# Altium schematic sheet 45. CAN TRANSCEIVERS.SchDoc: CAN TRANSCEIVERS
size 513 x 386 mm; Project: PROC154E2(001)_SK_AM69; Issue: 1.0; RevCode: E3; Page Create Date: March  8, 1995; Variant Name: Core Design; Schematic Page Number: 45; Page Number: 45; Page Size: C; Comment: MISTRAL_TITLEBLK_CSIZE_1; Page Count: 62; Schematic Page Count: 62; Name: PROC154E2 001 SK AM69; DsnPath: C:\Users\danie\Downloads\sprr466c\PROC154E3_RP\PROC154E3_SCH.DSN; SchematicName: SCHEMATIC1; PageName: 45. CAN TRANSCEIVERS; PageSize: C; TopSchematic: True
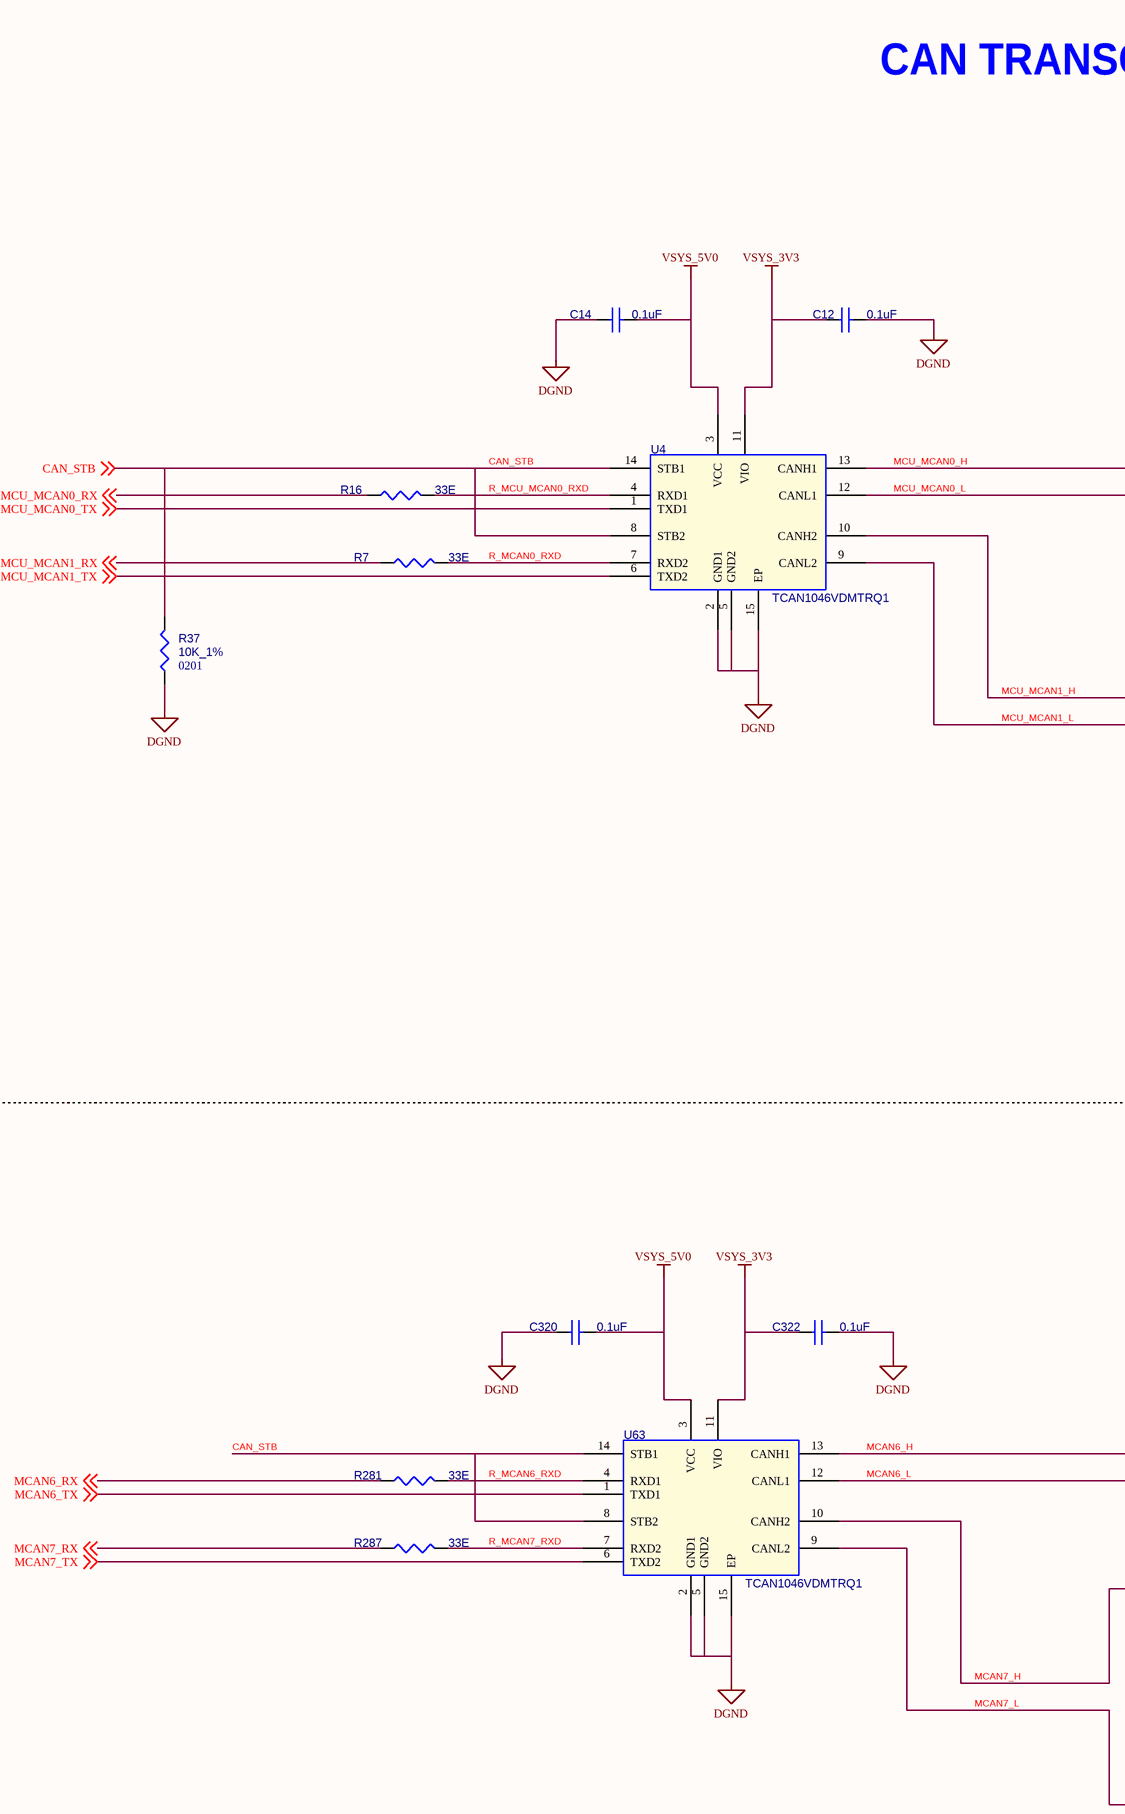
[diagram p0: 45. CAN TRANSCEIVERS.SchDoc, left]
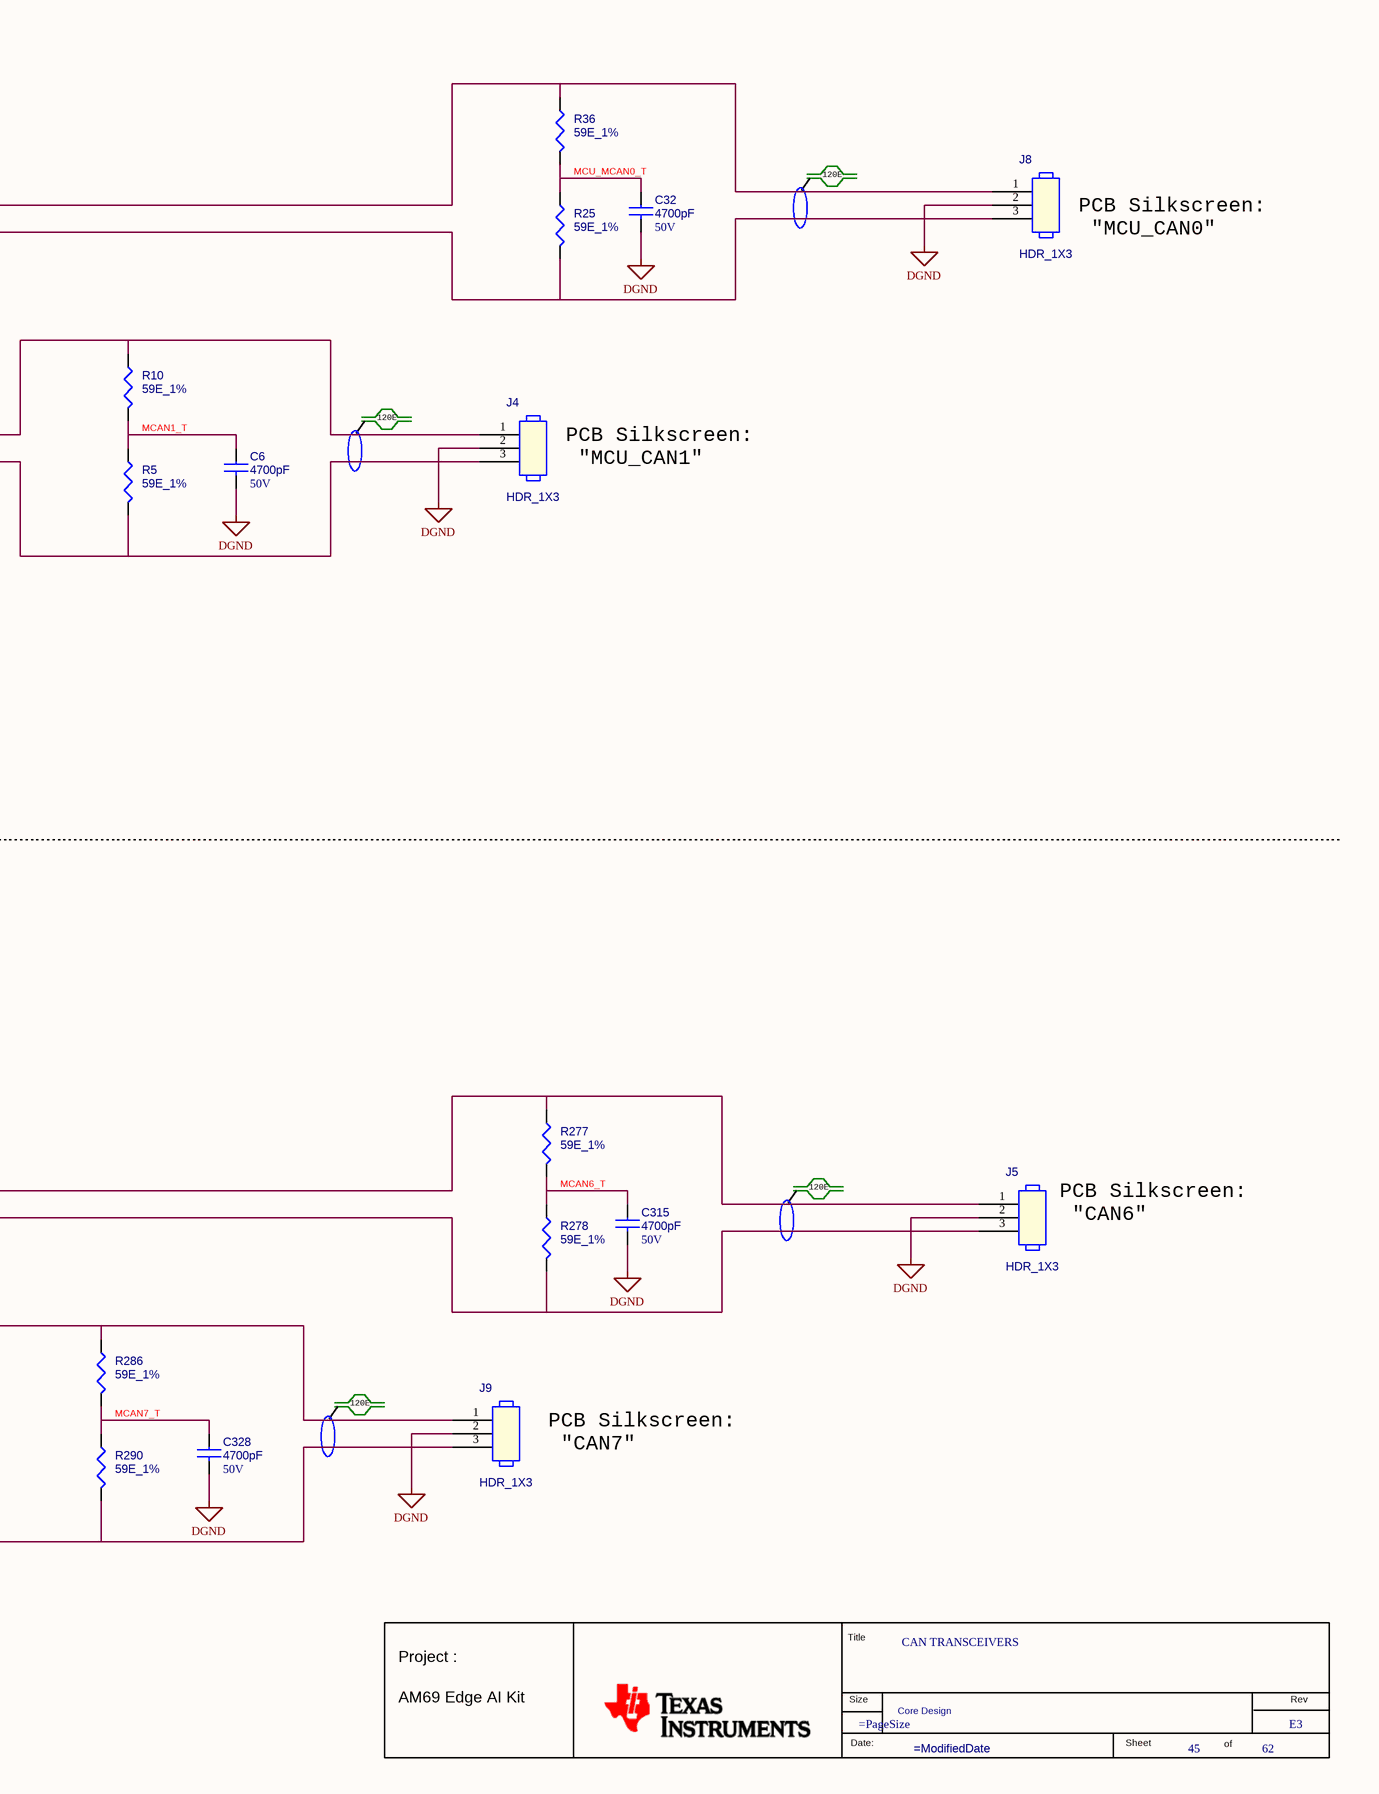
[diagram p1: 45. CAN TRANSCEIVERS.SchDoc, right]

## Parts
*  RevCode: E3  Title: CAN TRANSCEIVERS  Page Number: 45  Page Count: 62  Variant Name: Core Design  (hidden comment: MISTRAL_TITLEBLK_CSIZE_1)  (graphical)
C6  4700pF  Voltage: 50V  [CAP0402_0-75]
C12  0.1uF  [CAP0201_0-5]
C14  0.1uF  [CAP0201_0-5]
C32  4700pF  Voltage: 50V  [CAP0402_0-75]
C315  4700pF  Voltage: 50V  [CAP0402_0-75]
C320  0.1uF  [CAP0201_0-5]
C322  0.1uF  [CAP0201_0-5]
C328  4700pF  Voltage: 50V  [CAP0402_0-75]
J4  HDR_1X3  [HDR_1X3_100_S_T]
J5  HDR_1X3  [HDR_1X3_100_S_T]
J8  HDR_1X3  [HDR_1X3_100_S_T]
J9  HDR_1X3  [HDR_1X3_100_S_T]
R5  59E_1%  [RES0402_0-5]
R7  33E  [RES0201_0-5]
R10  59E_1%  [RES0402_0-5]
R16  33E  [RES0201_0-5]
R25  59E_1%  [RES0402_0-5]
R36  59E_1%  [RES0402_0-5]
R37  10K_1%  Package: 0201  [RES0201_0-5]
R277  59E_1%  [RES0402_0-5]
R278  59E_1%  [RES0402_0-5]
R281  33E  [RES0201_0-5]
R286  59E_1%  [RES0402_0-5]
R287  33E  [RES0201_0-5]
R290  59E_1%  [RES0402_0-5]
U4  TCAN1046VDMTRQ1  [VSON14_25-59_120X180_0-9]
U63  TCAN1046VDMTRQ1  [VSON14_25-59_120X180_0-9]

## Nets
DGND: C6.2 C12.2 C14.1 C32.2 C315.2 C320.1 C322.2 C328.2 J4.2 J5.2 J8.2 J9.2 R37.1 U4.2(GND1) U4.5(GND2) U4.15(EP) U63.2(GND1) U63.5(GND2) U63.15(EP)
VSYS_3V3: C12.1 C322.1 U4.11(VIO) U63.11(VIO)
VSYS_5V0: C14.2 C320.2 U4.3(VCC) U63.3(VCC)
CAN_STB: R37.2 U4.8(STB2) U4.14(STB1) U63.8(STB2) U63.14(STB1) ; off-sheet CAN_STB
MCAN1_T: C6.1 R5.1 R10.2
MCAN6_H: J5.1 R277.1 U63.13(CANH1)
MCAN6_L: J5.3 R278.2 U63.12(CANL1)
MCAN6_RX: R281.1 ; off-sheet MCAN6_RX
MCAN6_T: C315.1 R277.2 R278.1
MCAN6_TX: U63.1(TXD1) ; off-sheet MCAN6_TX
MCAN7_H: J9.1 R286.1 U63.10(CANH2)
MCAN7_L: J9.3 R290.2 U63.9(CANL2)
MCAN7_RX: R287.1 ; off-sheet MCAN7_RX
MCAN7_T: C328.1 R286.2 R290.1
MCAN7_TX: U63.6(TXD2) ; off-sheet MCAN7_TX
MCU_MCAN0_H: J8.1 R36.1 U4.13(CANH1)
MCU_MCAN0_L: J8.3 R25.2 U4.12(CANL1)
MCU_MCAN0_RX: R16.1 ; off-sheet MCU_MCAN0_RX
MCU_MCAN0_T: C32.1 R25.1 R36.2
MCU_MCAN0_TX: U4.1(TXD1) ; off-sheet MCU_MCAN0_TX
MCU_MCAN1_H: J4.1 R10.1 U4.10(CANH2)
MCU_MCAN1_L: J4.3 R5.2 U4.9(CANL2)
MCU_MCAN1_RX: R7.1 ; off-sheet MCU_MCAN1_RX
MCU_MCAN1_TX: U4.6(TXD2) ; off-sheet MCU_MCAN1_TX
R_MCAN0_RXD: R7.2 U4.7(RXD2)
R_MCAN6_RXD: R281.2 U63.4(RXD1)
R_MCAN7_RXD: R287.2 U63.7(RXD2)
R_MCU_MCAN0_RXD: R16.2 U4.4(RXD1)

## Notes on the sheet
- CAN TRANSCEIVERS
- 120E
- (near J8) PCB Silkscreen:
  "MCU_CAN0"
- (near J4) PCB Silkscreen:
  "MCU_CAN1"
- (near J5) PCB Silkscreen:
  "CAN6"
- PCB Silkscreen:
  "CAN7"
- (in symbol MISTRAL_TITLEBLK_CSIZE_1) Title; Project :; Size; Rev; AM69 Edge AI Kit; Date:; Sheet; of

## Library data of the parts
* = MISTRAL_TITLEBLK_CSIZE_1: Issue: 1.0; Project: PROC154E2(001)_SK_AM69; Name: PROC154E2 001 SK AM69; Page Create Date: March  8, 1995; Page Size: =PageSize; Page Modify Date: =ModifiedDate; Schematic Page Count: 62; Schematic Page Number: 45
C6 = CAP_Dup1: CAP CERAMIC 4700pF 50V 10% X7R AUTO 0402; Part Reference: C6; Part_type: CAPACITORS\CERAMIC; Mfr_part_number: GRT155R71H472KE01D; Mfr_name: MURATA; Mistral Part No: 120019020002-R; Custom_Duty: 15%; Customs_HS_Code: 85322990; Wattage: NA; Project: TI_DRA821 SK EVM BRD; Value: 4700pF; PCB Footprint: CAP0402_0-75; Chkd/date: MANIRAJA/250221; Crtd /date: ALVY/240221; Datasheet: Y:\MIS_DATABASE\DATASHEETS\CAPACITORS\GRT155R71H472KE01.PDF; Temperature: -55°C+125°C; Weight: NA; Height: 0.55MM; Library Ref: CAP; Distributor_part_number: 81-GRT155R71H472KE1D; Distributor_name: MOUSER; Package: 0402; Tolerance: 10%; Footprint Ref: CAP0402_0-75; MECHANICAL 3D STEP FILE: CAP0402_0-75; Library Path: Y:\MIS_DATABASE\Library\ALTIUM_TOOL\SCHEMATICS_PARTS\MS_DISCRETE_Library.schlib; Footprint Path: Y:\MIS_DATABASE\Library\ALTIUM_TOOL\PCB_FOOTPRINTS\Altium_Footprint_Lib.PcbLib
C12 = CAP_Dup1: CAP CERAMIC 0.1uF 16V 10% X7S AUTO 0201; Part Reference: C12; Mistral Part No: 120021030007-R; Mfr_name: MURATA; Mfr_part_number: GRT033C71C104KE01D; Part_type: CAPACITORS\CERAMIC; Project: J7ES_SK_BRD; Wattage: NA; Customs_HS_Code: 85322990; Custom_Duty: 15%; Value: 0.1uF; PCB Footprint: CAP0201_0-5; Tolerance: 10%; Voltage: 16V; Package: 0201; Distributor_name: DIGIKEY; Distributor_part_number: 490-GRT033C71C104KE01DTR-ND; Height: 0.33MM; Weight: 330mg; Temperature: -55°C+125°C; Datasheet: Y:\MIS_DATABASE\DATASHEETS\CAPACITORS\GRT033C71C104KE01.PDF; Crtd /date: ALVY/110321; Chkd/date: MANIRAJA/110321; MECHANICAL 3D STEP FILE: CAP0201_0-5
C14 = CAP_Dup1: CAP CERAMIC 0.1uF 16V 10% X7S AUTO 0201; Part Reference: C14; Part_type: CAPACITORS\CERAMIC; Mfr_part_number: GRT033C71C104KE01D; Mfr_name: MURATA; Mistral Part No: 120021030007-R; Custom_Duty: 15%; Customs_HS_Code: 85322990; Wattage: NA; Project: J7ES_SK_BRD; Value: 0.1uF; PCB Footprint: CAP0201_0-5; MECHANICAL 3D STEP FILE: CAP0201_0-5; Chkd/date: MANIRAJA/110321; Crtd /date: ALVY/110321; Datasheet: Y:\MIS_DATABASE\DATASHEETS\CAPACITORS\GRT033C71C104KE01.PDF; Temperature: -55°C+125°C; Weight: 330mg; Height: 0.33MM; Distributor_part_number: 490-GRT033C71C104KE01DTR-ND; Distributor_name: DIGIKEY; Package: 0201; Voltage: 16V; Tolerance: 10%
C32 = CAP_Dup1: CAP CERAMIC 4700pF 50V 10% X7R AUTO 0402; Part Reference: C32; Mistral Part No: 120019020002-R; Mfr_name: MURATA; Mfr_part_number: GRT155R71H472KE01D; Part_type: CAPACITORS\CERAMIC; Project: TI_DRA821 SK EVM BRD; Wattage: NA; Customs_HS_Code: 85322990; Custom_Duty: 15%; Value: 4700pF; PCB Footprint: CAP0402_0-75; Footprint Path: Y:\MIS_DATABASE\Library\ALTIUM_TOOL\PCB_FOOTPRINTS\Altium_Footprint_Lib.PcbLib; Library Path: Y:\MIS_DATABASE\Library\ALTIUM_TOOL\SCHEMATICS_PARTS\MS_DISCRETE_Library.schlib; MECHANICAL 3D STEP FILE: CAP0402_0-75; Footprint Ref: CAP0402_0-75; Tolerance: 10%; Package: 0402; Distributor_name: MOUSER; Distributor_part_number: 81-GRT155R71H472KE1D; Library Ref: CAP; Height: 0.55MM; Weight: NA; Temperature: -55°C+125°C; Datasheet: Y:\MIS_DATABASE\DATASHEETS\CAPACITORS\GRT155R71H472KE01.PDF; Crtd /date: ALVY/240221; Chkd/date: MANIRAJA/250221
C315 = CAP_Dup1: CAP CERAMIC 4700pF 50V 10% X7R AUTO 0402; Part Reference: C315; Mistral Part No: 120019020002-R; Mfr_name: MURATA; Mfr_part_number: GRT155R71H472KE01D; Part_type: CAPACITORS\CERAMIC; Project: TI_DRA821 SK EVM BRD; Wattage: NA; Customs_HS_Code: 85322990; Custom_Duty: 15%; Value: 4700pF; PCB Footprint: CAP0402_0-75; Footprint Path: Y:\MIS_DATABASE\Library\ALTIUM_TOOL\PCB_FOOTPRINTS\Altium_Footprint_Lib.PcbLib; Library Path: Y:\MIS_DATABASE\Library\ALTIUM_TOOL\SCHEMATICS_PARTS\MS_DISCRETE_Library.schlib; MECHANICAL 3D STEP FILE: CAP0402_0-75; Footprint Ref: CAP0402_0-75; Tolerance: 10%; Package: 0402; Distributor_name: MOUSER; Distributor_part_number: 81-GRT155R71H472KE1D; Library Ref: CAP; Height: 0.55MM; Weight: NA; Temperature: -55°C+125°C; Datasheet: Y:\MIS_DATABASE\DATASHEETS\CAPACITORS\GRT155R71H472KE01.PDF; Crtd /date: ALVY/240221; Chkd/date: MANIRAJA/250221
C320 = CAP_Dup1: CAP CERAMIC 0.1uF 16V 10% X7S AUTO 0201; Part Reference: C320; Mistral Part No: 120021030007-R; Mfr_name: MURATA; Mfr_part_number: GRT033C71C104KE01D; Part_type: CAPACITORS\CERAMIC; Project: J7ES_SK_BRD; Wattage: NA; Customs_HS_Code: 85322990; Custom_Duty: 15%; Value: 0.1uF; PCB Footprint: CAP0201_0-5; Tolerance: 10%; Voltage: 16V; Package: 0201; Distributor_name: DIGIKEY; Distributor_part_number: 490-GRT033C71C104KE01DTR-ND; Height: 0.33MM; Weight: 330mg; Temperature: -55°C+125°C; Datasheet: Y:\MIS_DATABASE\DATASHEETS\CAPACITORS\GRT033C71C104KE01.PDF; Crtd /date: ALVY/110321; Chkd/date: MANIRAJA/110321; MECHANICAL 3D STEP FILE: CAP0201_0-5
C322 = CAP_Dup1: CAP CERAMIC 0.1uF 16V 10% X7S AUTO 0201; Part Reference: C322; Mistral Part No: 120021030007-R; Mfr_name: MURATA; Mfr_part_number: GRT033C71C104KE01D; Part_type: CAPACITORS\CERAMIC; Project: J7ES_SK_BRD; Wattage: NA; Customs_HS_Code: 85322990; Custom_Duty: 15%; Value: 0.1uF; PCB Footprint: CAP0201_0-5; Tolerance: 10%; Voltage: 16V; Package: 0201; Distributor_name: DIGIKEY; Distributor_part_number: 490-GRT033C71C104KE01DTR-ND; Height: 0.33MM; Weight: 330mg; Temperature: -55°C+125°C; Datasheet: Y:\MIS_DATABASE\DATASHEETS\CAPACITORS\GRT033C71C104KE01.PDF; Crtd /date: ALVY/110321; Chkd/date: MANIRAJA/110321; MECHANICAL 3D STEP FILE: CAP0201_0-5
C328 = CAP_Dup1: CAP CERAMIC 4700pF 50V 10% X7R AUTO 0402; Part Reference: C328; Part_type: CAPACITORS\CERAMIC; Mfr_part_number: GRT155R71H472KE01D; Mfr_name: MURATA; Mistral Part No: 120019020002-R; Custom_Duty: 15%; Customs_HS_Code: 85322990; Wattage: NA; Project: TI_DRA821 SK EVM BRD; Value: 4700pF; PCB Footprint: CAP0402_0-75; Chkd/date: MANIRAJA/250221; Crtd /date: ALVY/240221; Datasheet: Y:\MIS_DATABASE\DATASHEETS\CAPACITORS\GRT155R71H472KE01.PDF; Temperature: -55°C+125°C; Weight: NA; Height: 0.55MM; Library Ref: CAP; Distributor_part_number: 81-GRT155R71H472KE1D; Distributor_name: MOUSER; Package: 0402; Tolerance: 10%; Footprint Ref: CAP0402_0-75; MECHANICAL 3D STEP FILE: CAP0402_0-75; Library Path: Y:\MIS_DATABASE\Library\ALTIUM_TOOL\SCHEMATICS_PARTS\MS_DISCRETE_Library.schlib; Footprint Path: Y:\MIS_DATABASE\Library\ALTIUM_TOOL\PCB_FOOTPRINTS\Altium_Footprint_Lib.PcbLib
J4 = HEADER_3X1: CON HDR 1X3 2.54MM PITCH ST TH; Part Reference: J4; Mistral Part No: 150015100037-R; Mfr_name: WURTH ELECTRONICS INC; Mfr_part_number: 61300311121; Part_type: CONNECTOR\HEADERS; Project: CYPHY_ROADKILL; Tolerance: NA; Customs_HS_Code: 85369090; Custom_Duty: 24%; Value: HDR_1X3; PCB Footprint: HDR_1X3_100_S_T; Voltage: NA; Wattage: NA; Package: THRU-HOLE; Distributor_name: DIGIKEY; Distributor_part_number: 732-5316-ND; Library Ref: HEADER_3X1; Height: 8.54MM; Weight: NA; Temperature: NA; Datasheet: Y:\MIS_DATABASE\DATASHEETS\CONNECTORS\6130XXX.PDF; Crtd /date: VASANTHA/211015; Chkd/date: VASANTHA/211015
J5 = HEADER_3X1: CON HDR 1X3 2.54MM PITCH ST TH; Part Reference: J5; Mistral Part No: 150015100037-R; Mfr_name: WURTH ELECTRONICS INC; Mfr_part_number: 61300311121; Part_type: CONNECTOR\HEADERS; Project: CYPHY_ROADKILL; Tolerance: NA; Customs_HS_Code: 85369090; Custom_Duty: 24%; Value: HDR_1X3; PCB Footprint: HDR_1X3_100_S_T; Voltage: NA; Wattage: NA; Package: THRU-HOLE; Distributor_name: DIGIKEY; Distributor_part_number: 732-5316-ND; Library Ref: HEADER_3X1; Height: 8.54MM; Weight: NA; Temperature: NA; Datasheet: Y:\MIS_DATABASE\DATASHEETS\CONNECTORS\6130XXX.PDF; Crtd /date: VASANTHA/211015; Chkd/date: VASANTHA/211015
J8 = HEADER_3X1: CON HDR 1X3 2.54MM PITCH ST TH; Part Reference: J8; Mistral Part No: 150015100037-R; Mfr_name: WURTH ELECTRONICS INC; Mfr_part_number: 61300311121; Part_type: CONNECTOR\HEADERS; Project: CYPHY_ROADKILL; Tolerance: NA; Customs_HS_Code: 85369090; Custom_Duty: 24%; Value: HDR_1X3; PCB Footprint: HDR_1X3_100_S_T; Voltage: NA; Wattage: NA; Package: THRU-HOLE; Distributor_name: DIGIKEY; Distributor_part_number: 732-5316-ND; Library Ref: HEADER_3X1; Height: 8.54MM; Weight: NA; Temperature: NA; Datasheet: Y:\MIS_DATABASE\DATASHEETS\CONNECTORS\6130XXX.PDF; Crtd /date: VASANTHA/211015; Chkd/date: VASANTHA/211015
J9 = HEADER_3X1: CON HDR 1X3 2.54MM PITCH ST TH; Part Reference: J9; Mistral Part No: 150015100037-R; Mfr_name: WURTH ELECTRONICS INC; Mfr_part_number: 61300311121; Part_type: CONNECTOR\HEADERS; Project: CYPHY_ROADKILL; Tolerance: NA; Customs_HS_Code: 85369090; Custom_Duty: 24%; Value: HDR_1X3; PCB Footprint: HDR_1X3_100_S_T; Voltage: NA; Wattage: NA; Package: THRU-HOLE; Distributor_name: DIGIKEY; Distributor_part_number: 732-5316-ND; Library Ref: HEADER_3X1; Height: 8.54MM; Weight: NA; Temperature: NA; Datasheet: Y:\MIS_DATABASE\DATASHEETS\CONNECTORS\6130XXX.PDF; Crtd /date: VASANTHA/211015; Chkd/date: VASANTHA/211015
R5 = RESISTOR_Dup2: RES 59E 1/10W 1% 0402; Part Reference: R5; Mistral Part No: 110009031010-R; Mfr_name: PANASONIC-ECG; Mfr_part_number: ERJ-2RKF59R0X; Part_type: RESISTORS\FIXED; Project: KHAN_HSST; Voltage: NA; Customs_HS_Code: 85332119; Custom_Duty: 15%; Value: 59E_1%; PCB Footprint: RES0402_0-5; Tolerance: 1%; Wattage: 1/10W; Package: 0402; Distributor_name: DIGIKEY; Distributor_part_number: P59.0LCT-ND; Library Ref: RESISTOR; Footprint Ref: RES0402_0-5; Height: 0.40MM; Weight: 0.8mg; Temperature: -55°C+155°C; Datasheet: Y:\MIS_DATABASE\DATASHEETS\RESISTORS\PAN-ERJSER_NOV17.PDF; Crtd /date: USMAN/031208; Chkd/date: MAZHAR/151208; MECHANICAL 3D STEP FILE: RES0402_0-5; Library Path: Y:\MIS_DATABASE\Library\ALTIUM_TOOL\SCHEMATICS_PARTS\MS_DISCRETE_Library.schlib; Footprint Path: Y:\MIS_DATABASE\Library\ALTIUM_TOOL\PCB_FOOTPRINTS\Altium_Footprint_Lib.PcbLib
R7 = RESISTOR_Dup2: RES 33E 1/20W 5% 0201; Part Reference: R7; Part_type: RESISTORS\FIXED; Mfr_part_number: ERJ-1GNJ330C; Mfr_name: PANASONIC-ECG; Mistral Part No: 110010070052-R; Custom_Duty: 15%; Customs_HS_Code: 85332119; Voltage: NA; Project: TI_AM62x_SKEVM_BRD; Value: 33E; PCB Footprint: RES0201_0-5; Footprint Path: Y:\MIS_DATABASE\Library\ALTIUM_TOOL\PCB_FOOTPRINTS\Altium_Footprint_Lib.PcbLib; Library Path: Y:\MIS_DATABASE\Library\ALTIUM_TOOL\SCHEMATICS_PARTS\MS_DISCRETE_Library.schlib; MECHANICAL 3D STEP FILE: RES0201_0-5; Chkd/date: ALVY/070422; Crtd /date: TAMILARASU/070422; Datasheet: Y:\MIS_DATABASE\DATASHEETS\RESISTORS\PAN-ERJSER_NOV17.PDF; Temperature: -55°C+125°C; Weight: 0.15mg; Height: 0.26MM; Distributor_part_number: P123303CT-ND; Distributor_name: DIGIKEY; Package: 0201; Wattage: 1/20W; Tolerance: 5%; Library Ref: RESISTOR; Footprint Ref: RES0201_0-5
R10 = RESISTOR_Dup2: RES 59E 1/10W 1% 0402; Part Reference: R10; Mistral Part No: 110009031010-R; Mfr_name: PANASONIC-ECG; Mfr_part_number: ERJ-2RKF59R0X; Part_type: RESISTORS\FIXED; Project: KHAN_HSST; Voltage: NA; Customs_HS_Code: 85332119; Custom_Duty: 15%; Value: 59E_1%; PCB Footprint: RES0402_0-5; Tolerance: 1%; Wattage: 1/10W; Package: 0402; Distributor_name: DIGIKEY; Distributor_part_number: P59.0LCT-ND; Library Ref: RESISTOR; Footprint Ref: RES0402_0-5; Height: 0.40MM; Weight: 0.8mg; Temperature: -55°C+155°C; Datasheet: Y:\MIS_DATABASE\DATASHEETS\RESISTORS\PAN-ERJSER_NOV17.PDF; Crtd /date: USMAN/031208; Chkd/date: MAZHAR/151208; MECHANICAL 3D STEP FILE: RES0402_0-5; Library Path: Y:\MIS_DATABASE\Library\ALTIUM_TOOL\SCHEMATICS_PARTS\MS_DISCRETE_Library.schlib; Footprint Path: Y:\MIS_DATABASE\Library\ALTIUM_TOOL\PCB_FOOTPRINTS\Altium_Footprint_Lib.PcbLib
R16 = RESISTOR_Dup2: RES 33E 1/20W 5% 0201; Part Reference: R16; Mistral Part No: 110010070052-R; Mfr_name: PANASONIC-ECG; Mfr_part_number: ERJ-1GNJ330C; Part_type: RESISTORS\FIXED; Project: TI_AM62x_SKEVM_BRD; Voltage: NA; Customs_HS_Code: 85332119; Custom_Duty: 15%; Value: 33E; PCB Footprint: RES0201_0-5; Footprint Ref: RES0201_0-5; Library Ref: RESISTOR; Tolerance: 5%; Wattage: 1/20W; Package: 0201; Distributor_name: DIGIKEY; Distributor_part_number: P123303CT-ND; Height: 0.26MM; Weight: 0.15mg; Temperature: -55°C+125°C; Datasheet: Y:\MIS_DATABASE\DATASHEETS\RESISTORS\PAN-ERJSER_NOV17.PDF; Crtd /date: TAMILARASU/070422; Chkd/date: ALVY/070422; MECHANICAL 3D STEP FILE: RES0201_0-5; Library Path: Y:\MIS_DATABASE\Library\ALTIUM_TOOL\SCHEMATICS_PARTS\MS_DISCRETE_Library.schlib; Footprint Path: Y:\MIS_DATABASE\Library\ALTIUM_TOOL\PCB_FOOTPRINTS\Altium_Footprint_Lib.PcbLib
R25 = RESISTOR_Dup2: RES 59E 1/10W 1% 0402; Part Reference: R25; Mistral Part No: 110009031010-R; Mfr_name: PANASONIC-ECG; Mfr_part_number: ERJ-2RKF59R0X; Part_type: RESISTORS\FIXED; Project: KHAN_HSST; Voltage: NA; Customs_HS_Code: 85332119; Custom_Duty: 15%; Value: 59E_1%; PCB Footprint: RES0402_0-5; Tolerance: 1%; Wattage: 1/10W; Package: 0402; Distributor_name: DIGIKEY; Distributor_part_number: P59.0LCT-ND; Library Ref: RESISTOR; Footprint Ref: RES0402_0-5; Height: 0.40MM; Weight: 0.8mg; Temperature: -55°C+155°C; Datasheet: Y:\MIS_DATABASE\DATASHEETS\RESISTORS\PAN-ERJSER_NOV17.PDF; Crtd /date: USMAN/031208; Chkd/date: MAZHAR/151208; MECHANICAL 3D STEP FILE: RES0402_0-5; Library Path: Y:\MIS_DATABASE\Library\ALTIUM_TOOL\SCHEMATICS_PARTS\MS_DISCRETE_Library.schlib; Footprint Path: Y:\MIS_DATABASE\Library\ALTIUM_TOOL\PCB_FOOTPRINTS\Altium_Footprint_Lib.PcbLib
R36 = RESISTOR_Dup2: RES 59E 1/10W 1% 0402; Part Reference: R36; Mistral Part No: 110009031010-R; Mfr_name: PANASONIC-ECG; Mfr_part_number: ERJ-2RKF59R0X; Part_type: RESISTORS\FIXED; Project: KHAN_HSST; Voltage: NA; Customs_HS_Code: 85332119; Custom_Duty: 15%; Value: 59E_1%; PCB Footprint: RES0402_0-5; Tolerance: 1%; Wattage: 1/10W; Package: 0402; Distributor_name: DIGIKEY; Distributor_part_number: P59.0LCT-ND; Library Ref: RESISTOR; Footprint Ref: RES0402_0-5; Height: 0.40MM; Weight: 0.8mg; Temperature: -55°C+155°C; Datasheet: Y:\MIS_DATABASE\DATASHEETS\RESISTORS\PAN-ERJSER_NOV17.PDF; Crtd /date: USMAN/031208; Chkd/date: MAZHAR/151208; MECHANICAL 3D STEP FILE: RES0402_0-5; Library Path: Y:\MIS_DATABASE\Library\ALTIUM_TOOL\SCHEMATICS_PARTS\MS_DISCRETE_Library.schlib; Footprint Path: Y:\MIS_DATABASE\Library\ALTIUM_TOOL\PCB_FOOTPRINTS\Altium_Footprint_Lib.PcbLib
R37 = RESISTOR_Dup2: RES 10K 1/20W 1% 0201; Part Reference: R37; Mistral Part No: 110011040018-R; Mfr_name: SAMSUNG; Mfr_part_number: RC0603F103CS; Part_type: RESISTORS\FIXED; Project: BRUKER_SD820_COMMONDO; Voltage: NA; Customs_HS_Code: 85332119; Custom_Duty: 15%; Value: 10K_1%; PCB Footprint: RES0201_0-5; Tolerance: 1%; Wattage: 1/20W; Distributor_name: DIGIKEY; Distributor_part_number: 1276-3670-1-ND; Height: 0.26MM; Weight: 0.15mg; Temperature: -55°C+125°C; Datasheet: Y:\MIS_DATABASE\DATASHEETS\RESISTORS\SAMSUNG_RC-SER.PDF; Crtd /date: ALVY/080519; Chkd/date: MANIRAJA/080519; MECHANICAL 3D STEP FILE: RES0201_0-5; Library Ref: RESISTOR; Footprint Ref: RES0201_0-5; Library Path: Y:\MIS_DATABASE\Library\ALTIUM_TOOL\SCHEMATICS_PARTS\MS_DISCRETE_Library.schlib; Footprint Path: Y:\MIS_DATABASE\Library\ALTIUM_TOOL\PCB_FOOTPRINTS\Altium_Footprint_Lib.PcbLib; Manufacturer: SAMSUNG
R277 = RESISTOR_Dup2: RES 59E 1/10W 1% 0402; Part Reference: R277; Mistral Part No: 110009031010-R; Mfr_name: PANASONIC-ECG; Mfr_part_number: ERJ-2RKF59R0X; Part_type: RESISTORS\FIXED; Project: KHAN_HSST; Voltage: NA; Customs_HS_Code: 85332119; Custom_Duty: 15%; Value: 59E_1%; PCB Footprint: RES0402_0-5; Tolerance: 1%; Wattage: 1/10W; Package: 0402; Distributor_name: DIGIKEY; Distributor_part_number: P59.0LCT-ND; Library Ref: RESISTOR; Footprint Ref: RES0402_0-5; Height: 0.40MM; Weight: 0.8mg; Temperature: -55°C+155°C; Datasheet: Y:\MIS_DATABASE\DATASHEETS\RESISTORS\PAN-ERJSER_NOV17.PDF; Crtd /date: USMAN/031208; Chkd/date: MAZHAR/151208; MECHANICAL 3D STEP FILE: RES0402_0-5; Library Path: Y:\MIS_DATABASE\Library\ALTIUM_TOOL\SCHEMATICS_PARTS\MS_DISCRETE_Library.schlib; Footprint Path: Y:\MIS_DATABASE\Library\ALTIUM_TOOL\PCB_FOOTPRINTS\Altium_Footprint_Lib.PcbLib
R278 = RESISTOR_Dup2: RES 59E 1/10W 1% 0402; Part Reference: R278; Mistral Part No: 110009031010-R; Mfr_name: PANASONIC-ECG; Mfr_part_number: ERJ-2RKF59R0X; Part_type: RESISTORS\FIXED; Project: KHAN_HSST; Voltage: NA; Customs_HS_Code: 85332119; Custom_Duty: 15%; Value: 59E_1%; PCB Footprint: RES0402_0-5; Tolerance: 1%; Wattage: 1/10W; Package: 0402; Distributor_name: DIGIKEY; Distributor_part_number: P59.0LCT-ND; Library Ref: RESISTOR; Footprint Ref: RES0402_0-5; Height: 0.40MM; Weight: 0.8mg; Temperature: -55°C+155°C; Datasheet: Y:\MIS_DATABASE\DATASHEETS\RESISTORS\PAN-ERJSER_NOV17.PDF; Crtd /date: USMAN/031208; Chkd/date: MAZHAR/151208; MECHANICAL 3D STEP FILE: RES0402_0-5; Library Path: Y:\MIS_DATABASE\Library\ALTIUM_TOOL\SCHEMATICS_PARTS\MS_DISCRETE_Library.schlib; Footprint Path: Y:\MIS_DATABASE\Library\ALTIUM_TOOL\PCB_FOOTPRINTS\Altium_Footprint_Lib.PcbLib
R281 = RESISTOR_Dup2: RES 33E 1/20W 5% 0201; Part Reference: R281; Mistral Part No: 110010070052-R; Mfr_name: PANASONIC-ECG; Mfr_part_number: ERJ-1GNJ330C; Part_type: RESISTORS\FIXED; Project: TI_AM62x_SKEVM_BRD; Voltage: NA; Customs_HS_Code: 85332119; Custom_Duty: 15%; Value: 33E; PCB Footprint: RES0201_0-5; Footprint Ref: RES0201_0-5; Library Ref: RESISTOR; Tolerance: 5%; Wattage: 1/20W; Package: 0201; Distributor_name: DIGIKEY; Distributor_part_number: P123303CT-ND; Height: 0.26MM; Weight: 0.15mg; Temperature: -55°C+125°C; Datasheet: Y:\MIS_DATABASE\DATASHEETS\RESISTORS\PAN-ERJSER_NOV17.PDF; Crtd /date: TAMILARASU/070422; Chkd/date: ALVY/070422; MECHANICAL 3D STEP FILE: RES0201_0-5; Library Path: Y:\MIS_DATABASE\Library\ALTIUM_TOOL\SCHEMATICS_PARTS\MS_DISCRETE_Library.schlib; Footprint Path: Y:\MIS_DATABASE\Library\ALTIUM_TOOL\PCB_FOOTPRINTS\Altium_Footprint_Lib.PcbLib
R286 = RESISTOR_Dup2: RES 59E 1/10W 1% 0402; Part Reference: R286; Mistral Part No: 110009031010-R; Mfr_name: PANASONIC-ECG; Mfr_part_number: ERJ-2RKF59R0X; Part_type: RESISTORS\FIXED; Project: KHAN_HSST; Voltage: NA; Customs_HS_Code: 85332119; Custom_Duty: 15%; Value: 59E_1%; PCB Footprint: RES0402_0-5; Tolerance: 1%; Wattage: 1/10W; Package: 0402; Distributor_name: DIGIKEY; Distributor_part_number: P59.0LCT-ND; Library Ref: RESISTOR; Footprint Ref: RES0402_0-5; Height: 0.40MM; Weight: 0.8mg; Temperature: -55°C+155°C; Datasheet: Y:\MIS_DATABASE\DATASHEETS\RESISTORS\PAN-ERJSER_NOV17.PDF; Crtd /date: USMAN/031208; Chkd/date: MAZHAR/151208; MECHANICAL 3D STEP FILE: RES0402_0-5; Library Path: Y:\MIS_DATABASE\Library\ALTIUM_TOOL\SCHEMATICS_PARTS\MS_DISCRETE_Library.schlib; Footprint Path: Y:\MIS_DATABASE\Library\ALTIUM_TOOL\PCB_FOOTPRINTS\Altium_Footprint_Lib.PcbLib
R287 = RESISTOR_Dup2: RES 33E 1/20W 5% 0201; Part Reference: R287; Part_type: RESISTORS\FIXED; Mfr_part_number: ERJ-1GNJ330C; Mfr_name: PANASONIC-ECG; Mistral Part No: 110010070052-R; Custom_Duty: 15%; Customs_HS_Code: 85332119; Voltage: NA; Project: TI_AM62x_SKEVM_BRD; Value: 33E; PCB Footprint: RES0201_0-5; Footprint Path: Y:\MIS_DATABASE\Library\ALTIUM_TOOL\PCB_FOOTPRINTS\Altium_Footprint_Lib.PcbLib; Library Path: Y:\MIS_DATABASE\Library\ALTIUM_TOOL\SCHEMATICS_PARTS\MS_DISCRETE_Library.schlib; MECHANICAL 3D STEP FILE: RES0201_0-5; Chkd/date: ALVY/070422; Crtd /date: TAMILARASU/070422; Datasheet: Y:\MIS_DATABASE\DATASHEETS\RESISTORS\PAN-ERJSER_NOV17.PDF; Temperature: -55°C+125°C; Weight: 0.15mg; Height: 0.26MM; Distributor_part_number: P123303CT-ND; Distributor_name: DIGIKEY; Package: 0201; Wattage: 1/20W; Tolerance: 5%; Library Ref: RESISTOR; Footprint Ref: RES0201_0-5
R290 = RESISTOR_Dup2: RES 59E 1/10W 1% 0402; Part Reference: R290; Mistral Part No: 110009031010-R; Mfr_name: PANASONIC-ECG; Mfr_part_number: ERJ-2RKF59R0X; Part_type: RESISTORS\FIXED; Project: KHAN_HSST; Voltage: NA; Customs_HS_Code: 85332119; Custom_Duty: 15%; Value: 59E_1%; PCB Footprint: RES0402_0-5; Tolerance: 1%; Wattage: 1/10W; Package: 0402; Distributor_name: DIGIKEY; Distributor_part_number: P59.0LCT-ND; Library Ref: RESISTOR; Footprint Ref: RES0402_0-5; Height: 0.40MM; Weight: 0.8mg; Temperature: -55°C+155°C; Datasheet: Y:\MIS_DATABASE\DATASHEETS\RESISTORS\PAN-ERJSER_NOV17.PDF; Crtd /date: USMAN/031208; Chkd/date: MAZHAR/151208; MECHANICAL 3D STEP FILE: RES0402_0-5; Library Path: Y:\MIS_DATABASE\Library\ALTIUM_TOOL\SCHEMATICS_PARTS\MS_DISCRETE_Library.schlib; Footprint Path: Y:\MIS_DATABASE\Library\ALTIUM_TOOL\PCB_FOOTPRINTS\Altium_Footprint_Lib.PcbLib
U4 = TCAN1046-Q1_VSON14: IC DUAL AUTOMOTIVE FAULT-PROTECTED CAN TRANSCEIVER VSON14; Part Reference: U4; Part_type: ICS\TELECOM\TRANSCEIVER; Mfr_name: TEXAS INSTRUMENTS; Mistral Part No: 143021010001-R; Custom_Duty: 15%; Customs_HS_Code: 85423100; Wattage: NA; Project: TI_DRA821 SK EVM BRD; Value: TCAN1046VDMTRQ1; PCB Footprint: VSON14_25-59_120X180_0-9; Footprint Path: Y:\MIS_DATABASE\Library\ALTIUM_TOOL\PCB_FOOTPRINTS\Altium_Footprint_Lib.PcbLib; Library Path: Y:\MIS_DATABASE\Library\ALTIUM_TOOL\SCHEMATICS_PARTS\MS_TELECOM_Library.schlib; MECHANICAL 3D STEP FILE: VSON14_25-59_120X180_0-9; Chkd/date: MANIRAJA/040121; Crtd /date: ALVY/301220; Datasheet: Y:\MIS_DATABASE\DATASHEETS\ICS\TELECOM\TCAN104X-Q1.PDF; Temperature: -40°C+125°C; Weight: 36.1mg; Height: 0.90MM; Library Ref: TCAN1046-Q1_VSON14; Distributor_part_number: 296-TCAN1046VDMTRQ1CT-ND; Distributor_name: DIGIKEY; Package: VSON14; Voltage: NA; Tolerance: NA; Mfr_part_number: TCAN1046VDMTRQ1; Footprint Ref: VSON14_25-59_120X180_0-9
U63 = TCAN1046-Q1_VSON14: IC DUAL AUTOMOTIVE FAULT-PROTECTED CAN TRANSCEIVER VSON14; Part Reference: U63; Mistral Part No: 143021010001-R; Mfr_name: TEXAS INSTRUMENTS; Part_type: ICS\TELECOM\TRANSCEIVER; Project: TI_DRA821 SK EVM BRD; Tolerance: NA; Customs_HS_Code: 85423100; Custom_Duty: 15%; Value: TCAN1046VDMTRQ1; PCB Footprint: VSON14_25-59_120X180_0-9; Footprint Ref: VSON14_25-59_120X180_0-9; Mfr_part_number: TCAN1046VDMTRQ1; Voltage: NA; Wattage: NA; Package: VSON14; Distributor_name: DIGIKEY; Distributor_part_number: 296-TCAN1046VDMTRQ1CT-ND; Library Ref: TCAN1046-Q1_VSON14; Height: 0.90MM; Weight: 36.1mg; Temperature: -40°C+125°C; Datasheet: Y:\MIS_DATABASE\DATASHEETS\ICS\TELECOM\TCAN104X-Q1.PDF; Crtd /date: ALVY/301220; Chkd/date: MANIRAJA/040121; MECHANICAL 3D STEP FILE: VSON14_25-59_120X180_0-9; Library Path: Y:\MIS_DATABASE\Library\ALTIUM_TOOL\SCHEMATICS_PARTS\MS_TELECOM_Library.schlib; Footprint Path: Y:\MIS_DATABASE\Library\ALTIUM_TOOL\PCB_FOOTPRINTS\Altium_Footprint_Lib.PcbLib